# Altium schematic sheet MotorDriver.SchDoc
size A4
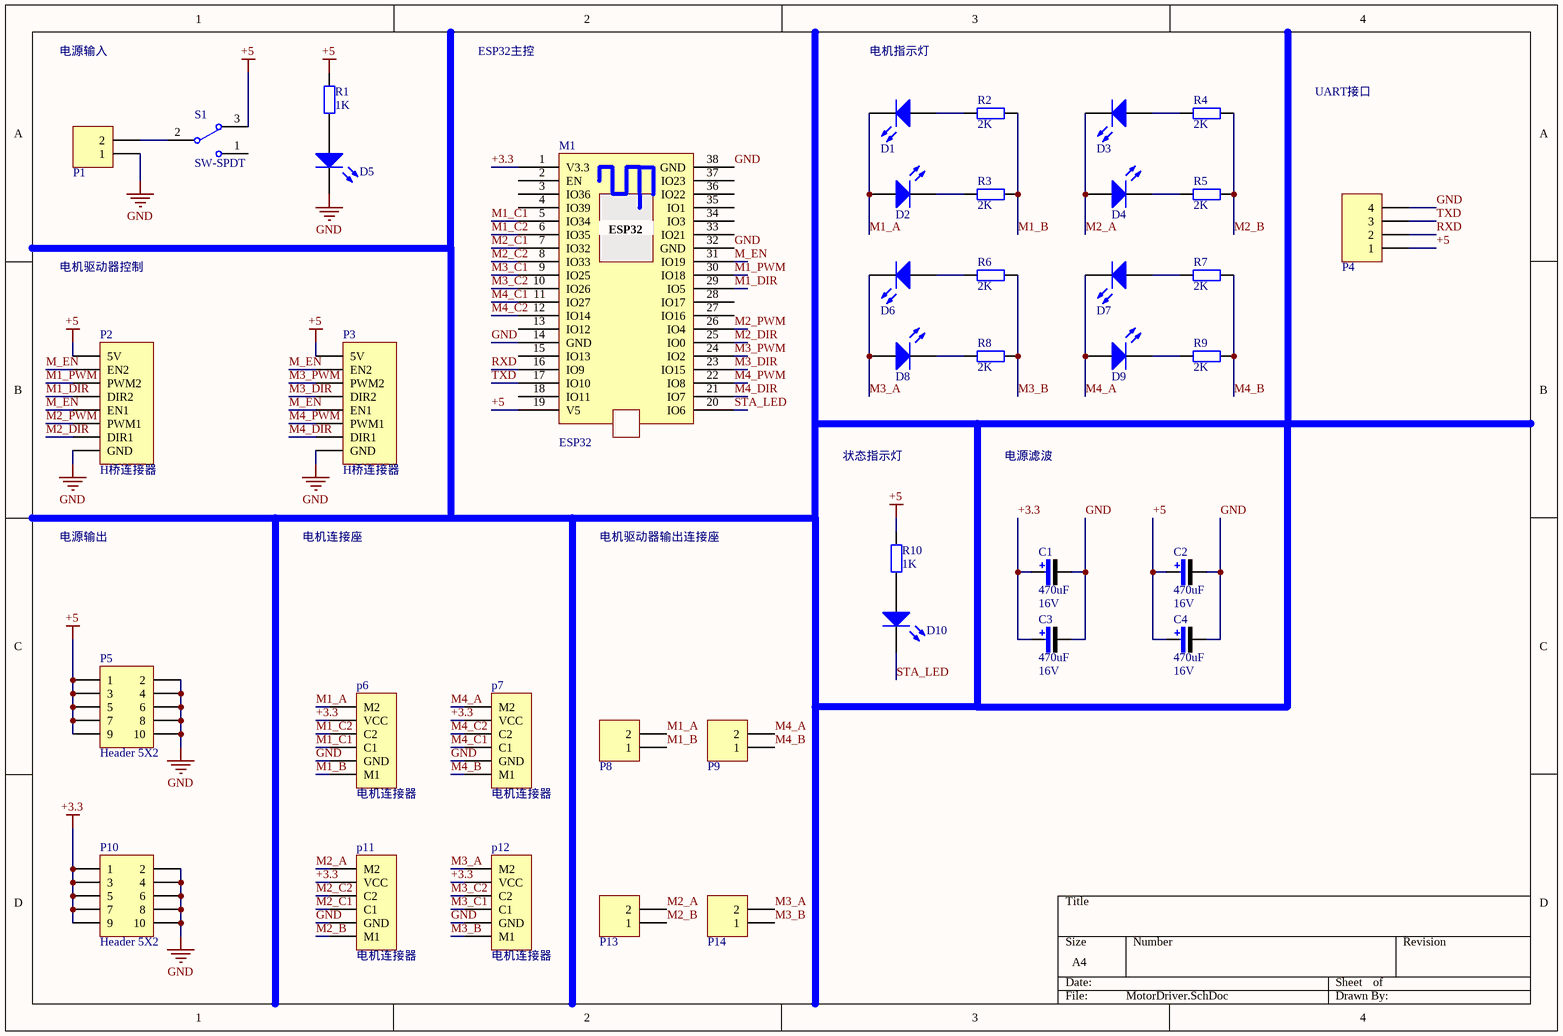
[diagram p0: MotorDriver.SchDoc]

## Parts
C1  value 470uF  Vol: 16V  [C-RB-8]  (hidden comment: Cap Pol)
C2  value 470uF  Vol: 16V  [C-RB-8]  (hidden comment: Cap Pol)
C3  value 470uF  Vol: 16V  [C-RB-8]  (hidden comment: Cap Pol)
C4  value 470uF  Vol: 16V  [C-RB-8]  (hidden comment: Cap Pol)
D1  LED0  [LED_DIP]  (value not drawn)
D2  LED0  [LED_DIP]  (value not drawn)
D3  LED0  [LED_DIP]  (value not drawn)
D4  LED0  [LED_DIP]  (value not drawn)
D5  LED0  [LED_DIP]  (value not drawn)
D6  LED0  [LED_DIP]  (value not drawn)
D7  LED0  [LED_DIP]  (value not drawn)
D8  LED0  [LED_DIP]  (value not drawn)
D9  LED0  [LED_DIP]  (value not drawn)
D10  LED0  [LED_DIP]  (value not drawn)
M1  ESP32  [ESP32-DEVKIT-38]
P1  Header 2  [HDR2X1_A]  (value not drawn)
P2  H桥连接器  [HDR8-PH2.54]
P3  H桥连接器  [HDR8-PH2.54]
P4  Header 4  [HDR4X1_A]  (value not drawn)
P5  Header 5X2  [HDR5X2_A1]
p6  电机连接器  [HDR6-XH2.54]
p7  电机连接器  [HDR6-XH2.54]
P8  Header 2  [HDR2X1_A]  (value not drawn)
P9  Header 2  [HDR2X1_A]  (value not drawn)
P10  Header 5X2  [HDR5X2_A1]
p11  电机连接器  [HDR6-XH2.54]
p12  电机连接器  [HDR6-XH2.54]
P13  Header 2  [HDR2X1_A]  (value not drawn)
P14  Header 2  [HDR2X1_A]  (value not drawn)
R1  value 1K  [0603-1]  (hidden comment: Res1)
R2  value 2K  [0603-1]  (hidden comment: Res1)
R3  value 2K  [0603-1]  (hidden comment: Res1)
R4  value 2K  [0603-1]  (hidden comment: Res1)
R5  value 2K  [0603-1]  (hidden comment: Res1)
R6  value 2K  [0603-1]  (hidden comment: Res1)
R7  value 2K  [0603-1]  (hidden comment: Res1)
R8  value 2K  [0603-1]  (hidden comment: Res1)
R9  value 2K  [0603-1]  (hidden comment: Res1)
R10  value 1K  [0603-1]  (hidden comment: Res1)
S1  SW-SPDT  [SWITCH_A1]

## Nets
+3.3: C1.1 C3.1 M1.1(V3.3) p6.2(VCC) p7.2(VCC) P10.1 P10.3 P10.5 P10.7 P10.9 p11.2(VCC) p12.2(VCC)
+5: C2.1 C4.1 M1.19(V5) P2.1(5V) P3.1(5V) P4.1 P5.1 P5.3 P5.5 P5.7 P5.9 R1.2 R10.2 S1.3
GND: C1.2 C2.2 C3.2 C4.2 D5.2(K) M1.14(GND) M1.32(GND) M1.38(GND) P1.1 P2.8(GND) P3.8(GND) P4.4 P5.2 P5.4 P5.6 P5.8 P5.10 p6.5(GND) p7.5(GND) P10.2 P10.4 P10.6 P10.8 P10.10 p11.5(GND) p12.5(GND)
M1_A: D1.2(K) D2.1(A) p6.1(M2) P8.2
M1_B: p6.6(M1) P8.1 R2.2 R3.2
M1_C1: M1.5(IO34) p6.4(C1)
M1_C2: M1.6(IO35) p6.3(C2)
M1_DIR: M1.29(IO5) P2.4(DIR2)
M1_PWM: M1.30(IO18) P2.3(PWM2)
M2_A: D3.2(K) D4.1(A) p11.1(M2) P13.2
M2_B: p11.6(M1) P13.1 R4.2 R5.2
M2_C1: M1.7(IO32) p11.4(C1)
M2_C2: M1.8(IO33) p11.3(C2)
M2_DIR: M1.25(IO0) P2.7(DIR1)
M2_PWM: M1.26(IO4) P2.6(PWM1)
M3_A: D6.2(K) D8.1(A) p12.1(M2) P14.2
M3_B: p12.6(M1) P14.1 R6.2 R8.2
M3_C1: M1.9(IO25) p12.4(C1)
M3_C2: M1.10(IO26) p12.3(C2)
M3_DIR: M1.23(IO15) P3.4(DIR2)
M3_PWM: M1.24(IO2) P3.3(PWM2)
M4_A: D7.2(K) D9.1(A) p7.1(M2) P9.2
M4_B: p7.6(M1) P9.1 R7.2 R9.2
M4_C1: M1.11(IO27) p7.4(C1)
M4_C2: M1.12(IO14) p7.3(C2)
M4_DIR: M1.21(IO7) P3.7(DIR1)
M4_PWM: M1.22(IO8) P3.6(PWM1)
M_EN: M1.31(IO19) P2.2(EN2) P2.5(EN1) P3.2(EN2) P3.5(EN1)
RXD: M1.16(IO9) P4.2
STA_LED: D10.2(K) M1.20(IO6)
TXD: M1.17(IO10) P4.3
NetD1_1: D1.1(A) R2.1
NetD2_2: D2.2(K) R3.1
NetD3_1: D3.1(A) R4.1
NetD4_2: D4.2(K) R5.1
NetD5_1: D5.1(A) R1.1
NetD6_1: D6.1(A) R6.1
NetD7_1: D7.1(A) R7.1
NetD8_2: D8.2(K) R8.1
NetD9_2: D9.2(K) R9.1
NetD10_1: D10.1(A) R10.1
NetP1_2: P1.2 S1.2

Not connected (* = marked no-connect by the designer): M1 2(EN) 3(IO36) 4(IO39) 13(IO12) 15(IO13) 18(IO11) 27(IO16) 28(IO17) 33(IO21) 34(IO3) 35(IO1) 36(IO22) 37(IO23); S1 1

## Notes on the sheet
- 电源输入
- ESP32主控
- 电机指示灯
- UART接口
- 电机驱动器控制
- 状态指示灯
- 电源滤波
- 电源输出
- 电机连接座
- 电机驱动器输出连接座

## Library data of the parts
C1-C4 = Cap Pol: 极性电解电容; Published: 8-Jun-2000; LatestRevisionDate: 17-Jul-2002; LatestRevisionNote: Re-released for DXP Platform.; PackageReference: RB7.6-15; Publisher: Altium Limited
D1-D10 = LED0: 发光二极管; Published: 8-Jun-2000; LatestRevisionDate: 08-Jul-2005; LatestRevisionNote: Mech Layer 1 removed.; PackageReference: LED-0; Publisher: Altium Limited
M1 = ESP32-DEVKIT-38: ESP32开发板，38引脚
P1 P8 P9 P13 P14 = Header 2: 接插件; LatestRevisionDate: 17-Jul-2002; LatestRevisionNote: Re-released for DXP Platform.; Publisher: Altium Limited
P2 P3 = Driver_Connector: 两路H桥连接器
P4 = Header 4: 接插件; LatestRevisionDate: 17-Jul-2002; LatestRevisionNote: Re-released for DXP Platform.; Publisher: Altium Limited
P5 P10 = Header 5X2: 接插件; LatestRevisionDate: 17-Jul-2002; LatestRevisionNote: Re-released for DXP Platform.; Publisher: Altium Limited
p6 p7 p11 p12 = Motor_Connector: 编码直流电机连接器
R1-R10 = Res1: 贴片电阻; Published: 8-Jun-2000; LatestRevisionDate: 17-Jul-2002; LatestRevisionNote: Re-released for DXP Platform.; PackageReference: AXIAL-0.4; Publisher: Altium Limited
S1 = SW-SPDT: 开关; Published: 24-Mar-1999; LatestRevisionDate: 17-Dec-2003; LatestRevisionNote: Schematic revised, PCB Footprint replaced.; DatasheetDocument: 05-Dec-2000; PackageReference: TL36WW15050; Publisher: Altium Limited; ComponentLink1Description: Manufacturer Link; ComponentLink1URL: http://www.apem.com